# EAGLE schematic Relay_Bypass_v1.1 (EAGLE 8.1.0)
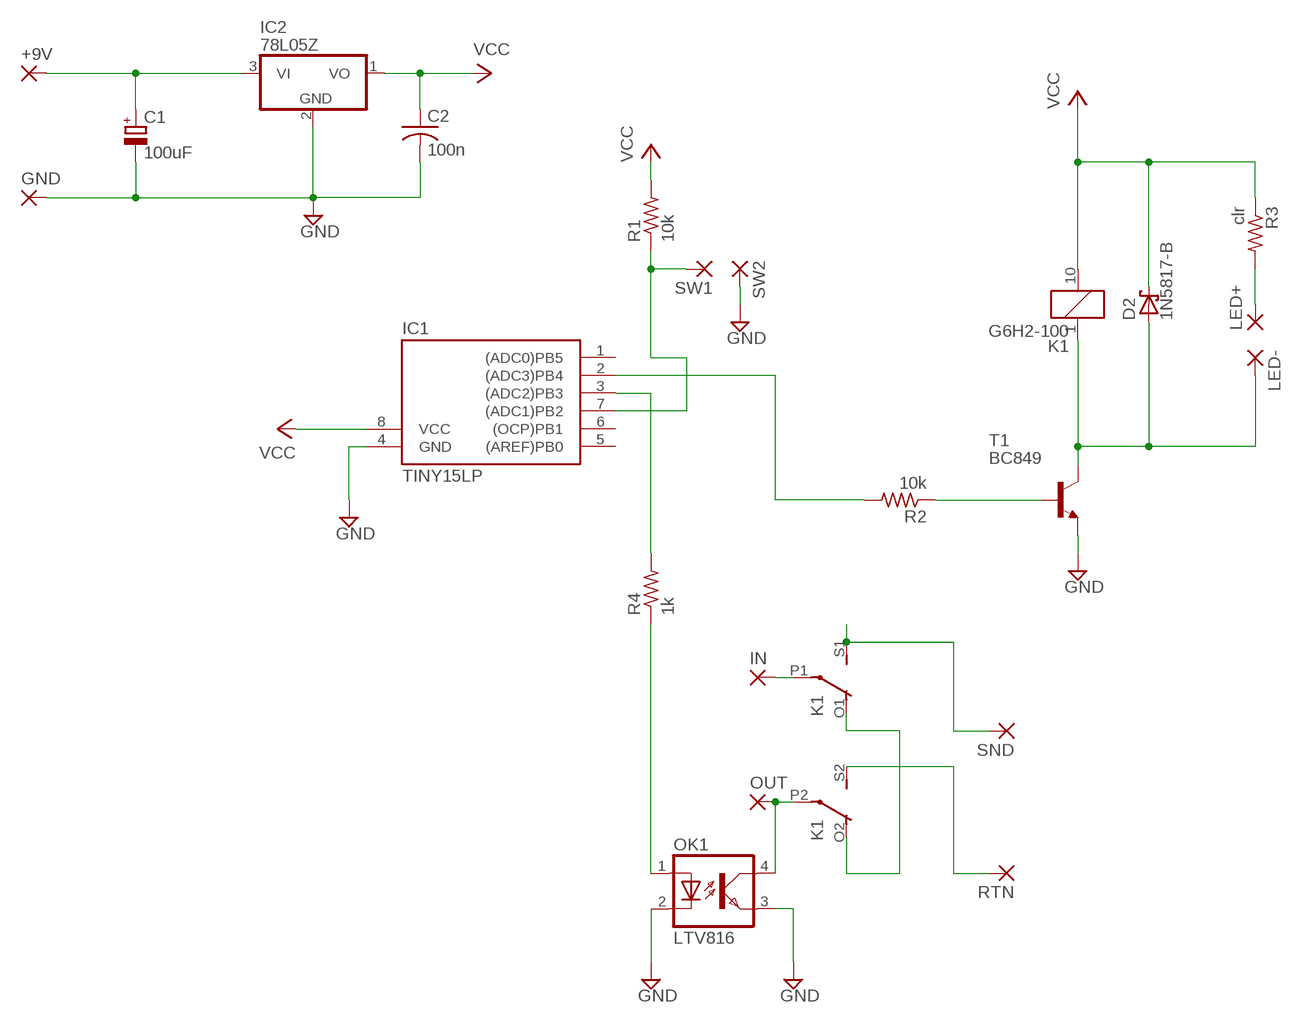
[diagram p0: schematic, sheet 1]

## Parts
+9V  2,54/0,9  [2,54/0,9]
C1  100uF  CPOL-EUE2.5-5  [E2,5-5]
C2  100n  C-US050-025X075  [C050-025X075]
D2  1N5817-B  [DO41-7.6]
GND  2,54/0,9  [2,54/0,9]
IC1  TINY15LP  [DIL08]
IC2  78L05Z  [TO92]
IN  2,54/0,9  [2,54/0,9]
K1  G6H2-100  [G6H2-100]
LED+  2,54/0,9  [2,54/0,9]
LED-  2,54/0,9  [2,54/0,9]
OK1  LTV816  [DIL04]
OUT  2,54/0,9  [2,54/0,9]
R1  10k  R-US_R0805  [R0805]
R2  10k  R-US_R0805  [R0805]
R3  clr  R-US_R0805  [R0805]
R4  1k  R-US_R0805  [R0805]
RTN  2,54/0,9  [2,54/0,9]
SND  2,54/0,9  [2,54/0,9]
SW1  2,54/0,9  [2,54/0,9]
SW2  2,54/0,9  [2,54/0,9]
T1  BC849  [SOT23]

## Nets
GND: C1.- C2.2 GND.1(P) IC1.4(GND) IC2.2(GND) OK1.2(C) OK1.3(EMIT) SW2.1(P) T1.2(E)
N$1: IC1.7((ADC1)PB2) R1.1 SW1.1(P)
N$2: +9V.1(P) C1.+ IC2.3(VI)
N$3: OK1.1(A) R4.1
N$4: K1.P2(3:P) OK1.4(COL) OUT.1(P)
N$5: IN.1(P) K1.P1(2:P)
N$6: K1.O1(2:O) K1.O2(3:O)
N$7: K1.S2(3:S) RTN.1(P)
N$9: IC1.2((ADC3)PB4) R2.2
N$10: IC1.3((ADC2)PB3) R4.2
N$11: R2.1 T1.1(B)
N$12: D2.A K1.1 LED-.1(P) T1.3(C)
N$13: K1.S1(2:S) SND.1(P)
N$15: LED+.1(P) R3.2
VCC: C2.1 D2.C IC1.8(VCC) IC2.1(VO) K1.10 R1.2 R3.1
Unconnected: IC1.1((ADC0)PB5) IC1.5((AREF)PB0) IC1.6((OCP)PB1)

## Library data of the parts
+9V GND IN LED+ LED- OUT RTN SND SW1 SW2 = wirepad:2,54/0,9: THROUGH-HOLE PAD
C1 = rcl:CPOL-EU: POLARIZED CAPACITOR, European symbol
C2 = rcl:C-US: CAPACITOR, American symbol
D2 = diode:1N581*: 1.0A SCHOTTKY BARRIER RECTIFIER Source: http://www.diodes.com/datasheets/ds23001.pdf
IC1 = atmel:TINY15L: MICROCONTROLLER 2.7 V 1 Kbytes FLASH 64 bytes EEPROM 4-channel 10 bit ADC; OC_FARNELL: unknown; OC_NEWARK: unknown
IC2 = linear:78*: Positive VOLTAGE REGULATOR Source: http://cache.national.com/ds/LM/LM78L05.pdf http://www.fairchildsemi.com/ds/LM/LM7805.pdf
K1 = relay:G6H2-100: RELAY 2 x switch, 0.5 A/125 V AC, 1 A/30 V DC, Omron; OC_FARNELL: unknown; OC_NEWARK: unknown
OK1 = optocoupler:LTV816: OPTO COUPLER Source: LITEON, LTV816.pdf; OC_FARNELL: unknown; OC_NEWARK: unknown
R1-R4 = rcl:R-US_: RESISTOR, American symbol
T1 = transistor-neu-to92:BC849: NPN TRANSISTOR